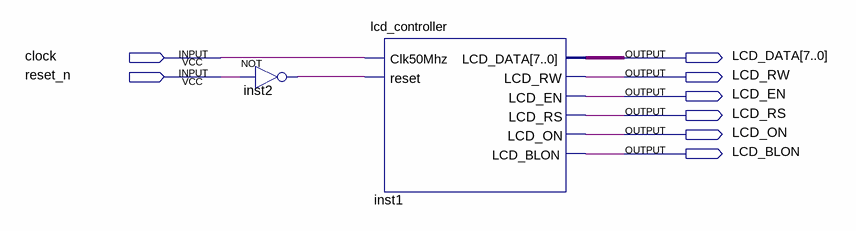
[diagram p0: schematic sheet]
// Quartus schematic top.bdf as structural Verilog: 2 symbols, 8 pins
module top (
  input  clock,
  input  reset_n,
  output [7:0] LCD_DATA,
  output LCD_RW,
  output LCD_EN,
  output LCD_RS,
  output LCD_ON,
  output LCD_BLON
);

  wire inst2_out;

  not inst2 (inst2_out, reset_n);
  lcd_controller inst1 (
    .Clk50Mhz(clock), .reset(inst2_out), .LCD_DATA(LCD_DATA), .LCD_RW(LCD_RW), .LCD_EN(LCD_EN),
    .LCD_RS(LCD_RS), .LCD_ON(LCD_ON), .LCD_BLON(LCD_BLON));
endmodule
